# EAGLE design lcdconnector3 (EAGLE 6.1)
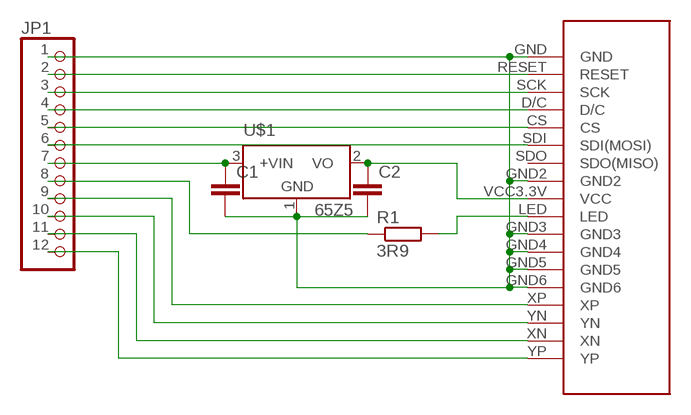
[diagram p0: schematic, sheet 1]

## Parts
C1  C-EUC0805  [C0805]
C2  C-EUC0805  [C0805]
CONNECTOR1  TJCTM24024-PINS  [TJCTM24024-PINS]
JP1  PINHD-1X12-CB  [1X12-CB]
R1  3R9  R-EU_R0805  [R0805]
U$1  65Z5  [SOT23]

## Nets
N$1: C1.2 C2.2 CONNECTOR1.GND CONNECTOR1.GND2 CONNECTOR1.GND3 CONNECTOR1.GND4 CONNECTOR1.GND5 CONNECTOR1.GND6 JP1.1 U$1.1(GND)
N$3: CONNECTOR1.RESET JP1.2
N$4: CONNECTOR1.SCK JP1.3
N$5: CONNECTOR1.D/C JP1.4
N$11: CONNECTOR1.CS JP1.5
N$12: CONNECTOR1.SDI(SDI(MOSI)) JP1.6
N$13: C1.1 JP1.7 U$1.3(+VIN)
N$14: C2.1 CONNECTOR1.VCC3.3V(VCC) U$1.2(VO)
N$16: CONNECTOR1.LED R1.2
N$17: JP1.8 R1.1
N$18: CONNECTOR1.XP JP1.9
N$19: CONNECTOR1.YN JP1.10
N$20: CONNECTOR1.XN JP1.11
N$21: CONNECTOR1.YP JP1.12
Unconnected: CONNECTOR1.SDO(SDO(MISO))

## Library data of the parts
C1 C2 = resistor:C-EU: CAPACITOR, European symbol
CONNECTOR1 = uradmonitor:TJCTM24024-PINS
JP1 = adafruit:PINHD-1X12: PIN HEADER
R1 = resistor:R-EU_: RESISTOR, European symbol
U$1 = uradmonitor:65Z5: 3V regulator XC6206P302MR 65Z5 http://datasheet.octopart.com/XC6206P302MR-Torex-datasheet-514348.pdf

## Net classes
1 power: width 0.254 mm

## Board
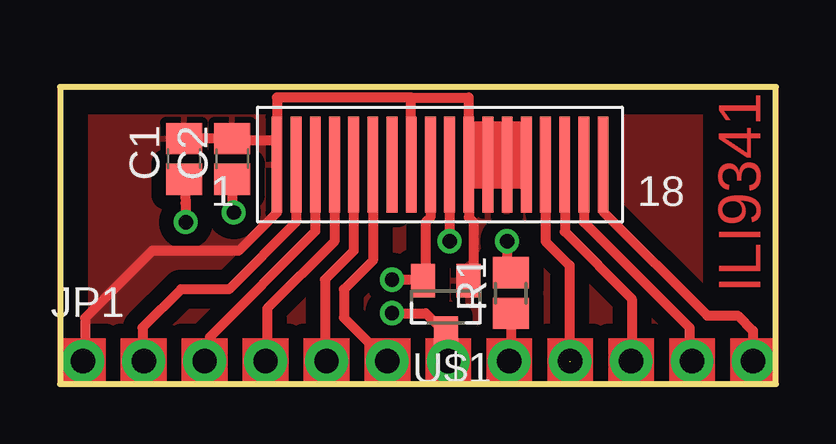
[diagram p1: board, top side]
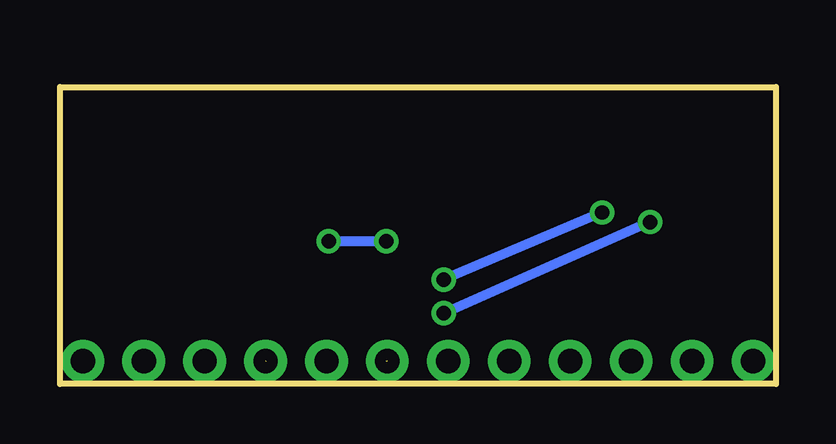
[diagram p2: board, bottom side, seen from below]

Size 29.84 x 12.38 mm. Coordinates in mm from the lower left corner, seen from the top.
Outline: 0,0 29.84,0 29.84,12.38 0,12.38 0,0
Copper layers (1*16): Top 0.035mm / dielectric 1.5mm / Bottom 0.035mm
Design rules: minimum track width 10mil, minimum drill 24mil, track to track 8mil, track to pad 8mil, pad to pad 8mil, via to via 8mil, smd to smd 8mil, copper to edge 40mil, drill to drill 8mil, minimum pad ring 10mil, minimum via ring 8mil, stop-mask expansion 4mil, vias tented up to drill 0mil, thermal gap 10mil

### Footprints (pad centres in the part's own frame; a part is rotated, then mirrored left to right if it is on the bottom)
C0805 = smd 1.3 x 1.5: 1 -0.85,0; 2 0.85,0
TJCTM24024-PINS = smd 0.45 x 4: CS -8,-0.8; D/C -8.8,-0.8; GND -11.2,-0.8; GND2 -5.6,-0.8; GND3 -3.2,-0.8; GND4 -2.4,-0.8; GND5 -1.6,-0.8; GND6 -0.8,-0.8; LED -4,-0.8; RESET -10.4,-0.8; SCK -9.6,-0.8; SDI -7.2,-0.8; SDO -6.4,-0.8; VCC3.3V -4.8,-0.8; XN 1.6,-0.8; XP 0,-0.8; YN 0.8,-0.8; YP 2.4,-0.8
1X12-CB = drill 1.016 pad 1.778: 1 -13.97,0; 2 -11.43,0; 3 -8.89,0; 4 -6.35,0; 5 -3.81,0; 6 -1.27,0; 7 1.27,0; 8 3.81,0; 9 6.35,0; 10 8.89,0; 11 11.43,0; 12 13.97,0
R0805 = smd 1.3 x 1.5: 1 -0.85,0; 2 0.85,0
SOT23 = smd 1 x 1.4: 1 -0.95,-1.1; 2 0.95,-1.1; 3 0,1.1

### Placement (x,y rotation side)
C1  5.17,9.39 90 top
C2  7.18,9.39 90 top
CONNECTOR1  20.24,9.95 0 top
JP1  14.92,0.95 0 top
R1  18.79,3.79 90 top
U$1  16.08,3.22 180 top

### Tracks (layer width: path | path; a pad name or v marks a point on that pad's centre or on a via)
N$1
  Top 0.406: CONNECTOR1.GND6 CONNECTOR1.GND5 CONNECTOR1.GND4 CONNECTOR1.GND3 | CONNECTOR1.GND2 14.64,11.95 | 14.64,11.95 9.04,11.95 9.04,10.15 | CONNECTOR1.GND3 17.04,11.95 14.64,11.95 | JP1.1 1.04,1.04 1.04,2.75 3.84,5.55 7.44,5.55 9.04,7.15 CONNECTOR1.GND 9.04,10.15 | 16.93,4.62 U$1.1 17.24,4.52 17.24,6.75 17.04,6.95 CONNECTOR1.GND3 | 9.04,10.15 7.28,10.15 C2.2 C1.2
  pour Top (isolate 0.61): 0,12.38 29.84,12.38 29.84,0 0,0
N$3
  Top 0.406: CONNECTOR1.RESET 9.84,6.75 7.04,3.95 5.04,3.95 3.44,2.35 3.44,1 JP1.2
N$4
  Top 0.406: CONNECTOR1.SCK 10.64,6.36 6.24,1.95 6.24,0.95 JP1.3
N$5
  Top 0.406: CONNECTOR1.D/C 11.44,5.95 8.64,3.15 8.64,1.02 JP1.4
N$7  (via drill 0.6)
  other vias: 0.95,0.95
N$8  (via drill 0.6)
  other vias: 3.49,0.95
N$9  (via drill 0.6)
  other vias: 6.03,0.95
N$10  (via drill 0.6)
  other vias: 8.57,0.95
N$11
  Top 0.406: CONNECTOR1.CS 12.24,5.55 11.04,4.35 11.04,1.02 JP1.5
N$12
  Top 0.406: CONNECTOR1.SDI 13.04,5.15 11.84,3.95 11.84,2.76 JP1.6
N$13  (via drill 0.6)  (1 unrouted)
  Top 0.406: 16.19,2.42 U$1.3 | U$1.3 16.08,1.06 JP1.7 | C1.1 5.23,7.54 v5.24,6.75 | 16.24,0.95 16.24,1.95 16.04,2.15 | v13.84,2.95 15.25,2.95 U$1.3
  Bottom 0.406: v5.24,6.75 v13.84,2.95
N$14  (via drill 0.6)
  Top 0.406: 15.23,4.61 U$1.2 15.17,4.35 | CONNECTOR1.VCC3.3V 15.44,6.95 15.24,6.75 15.24,4.42 15.17,4.35 | C2.1 7.18,7.1 v7.24,7.15 | v13.84,4.35 15.17,4.35
  Bottom 0.406: v7.24,7.15 v13.84,4.35
N$16  (via drill 0.6)
  Top 0.406: v18.64,5.95 18.64,4.8 R1.2 | 16.24,8.95 CONNECTOR1.LED v16.24,5.95
  Bottom 0.406: v16.24,5.95 v18.64,5.95
N$17
  Top 0.406: R1.1 18.79,1.02 JP1.8
N$18  (1 unrouted)
  Top 0.406: CONNECTOR1.XP 20.24,5.95 21.24,4.95 21.24,0.95
N$19
  Top 0.406: CONNECTOR1.YN 21.04,6.35 23.84,3.55 23.84,0.98 JP1.10
N$20
  Top 0.406: CONNECTOR1.XN 21.84,6.75 26.24,2.35 26.24,1.06 JP1.11
N$21
  Top 0.406: CONNECTOR1.YP 22.64,7.2 26.99,2.86 28.26,2.86 28.89,2.22 JP1.12
N$24  (via drill 0.6)
  other vias: 11.11,0.95
N$25  (via drill 0.6)
  other vias: 13.65,0.95
N$26  (via drill 0.6)
  other vias: 16.19,0.95
N$27  (via drill 0.6)
  other vias: 18.73,0.95
N$28  (via drill 0.6)
  other vias: 21.27,0.95
N$29  (via drill 0.6)
  other vias: 23.81,0.95
N$30  (via drill 0.6)
  other vias: 26.35,0.95
N$31  (via drill 0.6)
  other vias: 28.89,0.95
(copper drawn outside any net)
  shapes: Top area x13

### Text on the board
Top: ILI9341